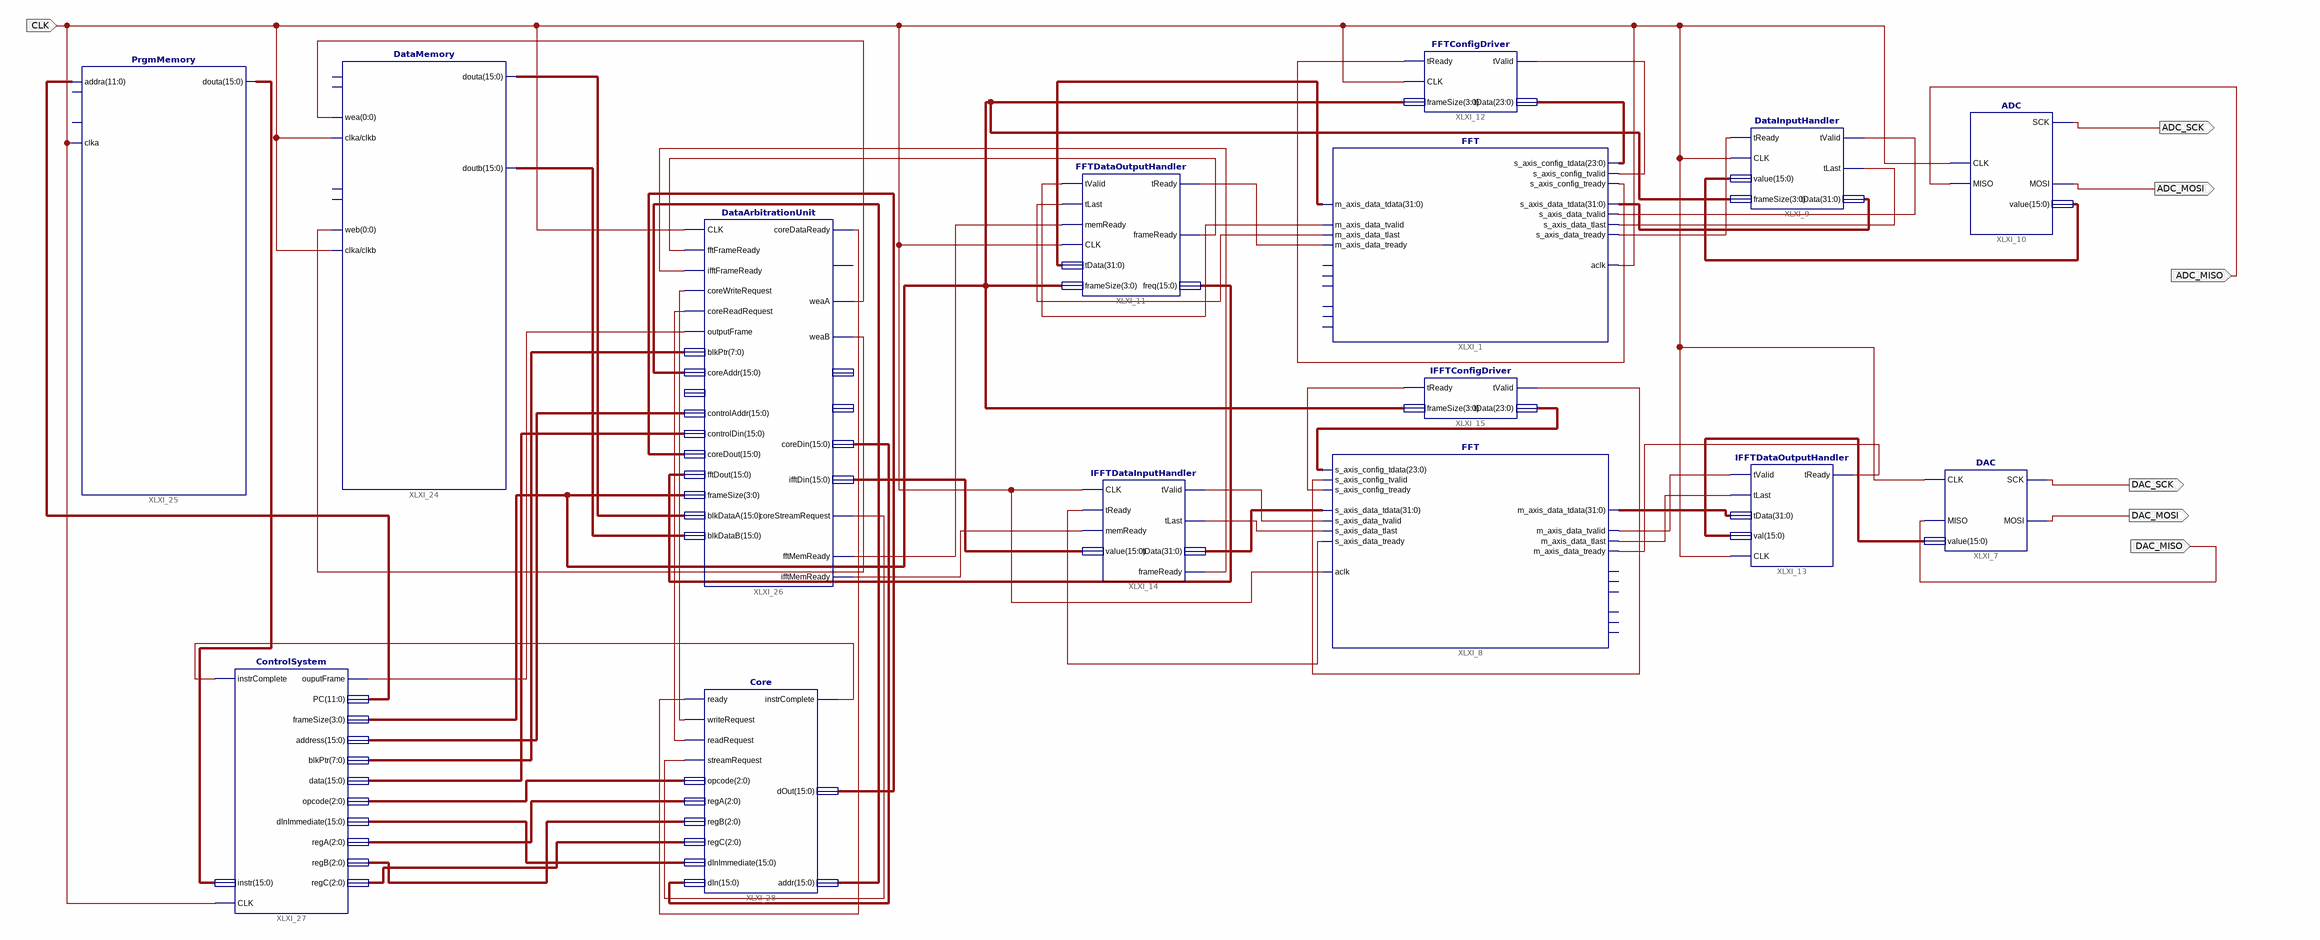
[diagram p0: schematic sheet 1]
// Xilinx ISE schematic AudioProcessor.sch (spartan6) as structural Verilog: 15 symbols, 7 ports
module AudioProcessor (
  input  DAC_MISO,
  input  ADC_MISO,
  input  CLK,
  output DAC_SCK,
  output DAC_MOSI,
  output ADC_MOSI,
  output ADC_SCK
);

  wire XLXN_7, XLXN_8, XLXN_9, XLXN_11, XLXN_12, XLXN_13, XLXN_15, XLXN_16, XLXN_25, XLXN_27, XLXN_28,
       XLXN_33, XLXN_34, XLXN_35, XLXN_38, XLXN_39, XLXN_184, XLXN_193, XLXN_194, XLXN_195, XLXN_196,
       XLXN_206, XLXN_210, XLXN_222, XLXN_223, XLXN_224;
  wire [0:0] XLXN_191, XLXN_192;
  wire [2:0] XLXN_200, XLXN_203, XLXN_204, XLXN_205;
  wire [3:0] XLXN_216;
  wire [7:0] XLXN_225;
  wire [11:0] XLXN_208;
  wire [15:0] XLXN_10, XLXN_29, XLXN_185, XLXN_186, XLXN_189, XLXN_190, XLXN_197, XLXN_198, XLXN_199,
       XLXN_202, XLXN_207, XLXN_211, XLXN_214;
  wire [23:0] XLXN_17, XLXN_40;
  wire [31:0] XLXN_6, XLXN_14, XLXN_24, XLXN_36;

  DataMemory XLXI_24 (
    .wea(XLXN_191[0]), .clka(CLK), .web(XLXN_192[0]), .clkb(CLK), .douta(XLXN_189), .doutb(XLXN_190));  // open: addra, dina, addrb, dinb
  PrgmMemory XLXI_25 (.addra(XLXN_208), .clka(CLK), .douta(XLXN_207));  // open: dina, wea
  ADC XLXI_10 (.MISO(ADC_MISO), .CLK(CLK), .MOSI(ADC_MOSI), .SCK(ADC_SCK), .value(XLXN_10));
  DataInputHandler XLXI_9 (
    .tReady(XLXN_7), .CLK(CLK), .value(XLXN_10), .frameSize(XLXN_216), .tValid(XLXN_8), .tLast(XLXN_9),
    .tData(XLXN_6));
  DAC XLXI_7 (.MISO(DAC_MISO), .CLK(CLK), .value(XLXN_29), .MOSI(DAC_MOSI), .SCK(DAC_SCK));
  IFFTDataOutputHandler XLXI_13 (
    .tValid(XLXN_25), .tLast(XLXN_27), .tData(XLXN_24), .val(XLXN_29), .tReady(XLXN_28), .CLK(CLK));
  FFT XLXI_8 (
    .s_axis_config_tdata(XLXN_40), .s_axis_config_tvalid(XLXN_39), .s_axis_config_tready(XLXN_38),
    .s_axis_data_tdata(XLXN_36), .s_axis_data_tvalid(XLXN_33), .s_axis_data_tlast(XLXN_34),
    .s_axis_data_tready(XLXN_35), .aclk(CLK), .m_axis_data_tdata(XLXN_24), .m_axis_data_tvalid(XLXN_25),
    .m_axis_data_tlast(XLXN_27), .m_axis_data_tready(XLXN_28));  // open: event_frame_started, event_tlast_unexpected, event_tlast_missing, event_data_in_channel_halt, event_status_channel_halt, event_data_out_channel_halt
  FFT XLXI_1 (
    .s_axis_config_tdata(XLXN_17), .s_axis_config_tvalid(XLXN_15), .s_axis_config_tready(XLXN_16),
    .s_axis_data_tdata(XLXN_6), .s_axis_data_tvalid(XLXN_8), .s_axis_data_tlast(XLXN_9),
    .s_axis_data_tready(XLXN_7), .aclk(CLK), .m_axis_data_tdata(XLXN_14), .m_axis_data_tvalid(XLXN_12),
    .m_axis_data_tlast(XLXN_13), .m_axis_data_tready(XLXN_11));  // open: event_frame_started, event_tlast_unexpected, event_tlast_missing, event_data_in_channel_halt, event_status_channel_halt, event_data_out_channel_halt
  FFTDataOutputHandler XLXI_11 (
    .tValid(XLXN_12), .tLast(XLXN_13), .memReady(XLXN_223), .CLK(CLK), .tData(XLXN_14), .frameSize(XLXN_216),
    .tReady(XLXN_11), .frameReady(XLXN_184), .freq(XLXN_185));
  FFTConfigDriver XLXI_12 (.tReady(XLXN_16), .CLK(CLK), .frameSize(XLXN_216), .tValid(XLXN_15), .tData(XLXN_17));
  IFFTDataInputHandler XLXI_14 (
    .CLK(CLK), .tReady(XLXN_35), .memReady(XLXN_222), .value(XLXN_186), .tValid(XLXN_33), .tLast(XLXN_34),
    .frameReady(XLXN_224), .tData(XLXN_36));
  IFFTConfigDriver XLXI_15 (.tReady(XLXN_38), .frameSize(XLXN_216), .tValid(XLXN_39), .tData(XLXN_40));
  DataArbitrationUnit XLXI_26 (
    .CLK(CLK), .fftFrameReady(XLXN_184), .ifftFrameReady(XLXN_224), .coreWriteRequest(XLXN_194),
    .coreReadRequest(XLXN_195), .outputFrame(XLXN_210), .blkPtr(XLXN_225), .coreAddr(XLXN_199),
    .controlAddr(XLXN_214), .controlDin(XLXN_211), .coreDout(XLXN_198), .fftDout(XLXN_185),
    .frameSize(XLXN_216), .blkDataA(XLXN_189), .blkDataB(XLXN_190), .coreStreamRequest(XLXN_196),
    .coreDataReady(XLXN_193), .weaA(XLXN_191[0]), .weaB(XLXN_192[0]), .fftMemReady(XLXN_223),
    .ifftMemReady(XLXN_222), .coreDin(XLXN_197), .ifftDin(XLXN_186));  // open: iFFFTDataReady, blkAddrA, blkAddrB
  ControlSystem XLXI_27 (
    .instrComplete(XLXN_206), .instr(XLXN_207), .ouputFrame(XLXN_210), .PC(XLXN_208), .frameSize(XLXN_216),
    .address(XLXN_214), .blkPtr(XLXN_225), .data(XLXN_211), .opcode(XLXN_200), .dInImmediate(XLXN_202),
    .regA(XLXN_203), .regB(XLXN_204), .regC(XLXN_205), .CLK(CLK));
  Core XLXI_28 (
    .ready(XLXN_193), .writeRequest(XLXN_194), .readRequest(XLXN_195), .streamRequest(XLXN_196),
    .opcode(XLXN_200), .regA(XLXN_203), .regB(XLXN_204), .regC(XLXN_205), .dInImmediate(XLXN_202),
    .dIn(XLXN_197), .instrComplete(XLXN_206), .dOut(XLXN_198), .addr(XLXN_199));
endmodule
